# Altium schematic sheet LIS3DHTR_C151341_LIS3DHTR_C15134.schdoc
size 127 x 99 mm
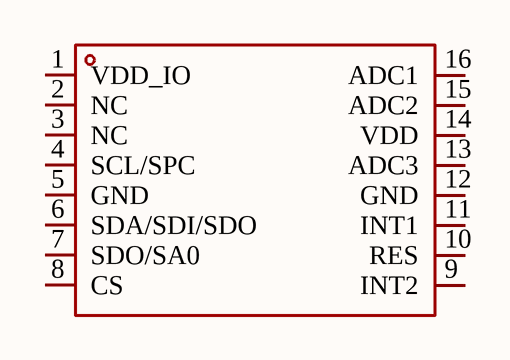
[diagram p0: LIS3DHTR_C151341_LIS3DHTR_C15134.schdoc]

## Parts
U?  LIS3DHTR  [LGA-16_L3.0-W3.0-P0.50-TL]  (value not drawn)

## Nets

Not connected (* = marked no-connect by the designer): U? 1(VDD_IO) 2(NC) 3(NC) 4(SCL/SPC) 5(GND) 6(SDA/SDI/SDO) 7(SDO/SA0) 8(CS) 9(INT2) 10(RES) 11(INT1) 12(GND) 13(ADC3) 14(VDD) 15(ADC2) 16(ADC1)

## Library data of the parts
U? = LIS3DHTR: Manufacturer: ST(意法半导体); Symbol: LIS3DHTR_C15134; Add into BOM: yes; Voltage - Supply: 1.71V~3.6V; Device: LIS3DHTR; LCSC Part Name: LIS3DHTR; Supplier Part: C15134; Manufacturer Part: LIS3DHTR; Supplier Footprint: LGA-16(3x3); JLCPCB Part Class: Extended Part; Datasheet: https://item.szlcsc.com/datasheet/LIS3DHTR/15808.html; Supplier: LCSC; Convert to PCB: yes; Operating Temperature: -40℃~+85℃